# EAGLE design door_sensor (EAGLE 8.1.0)
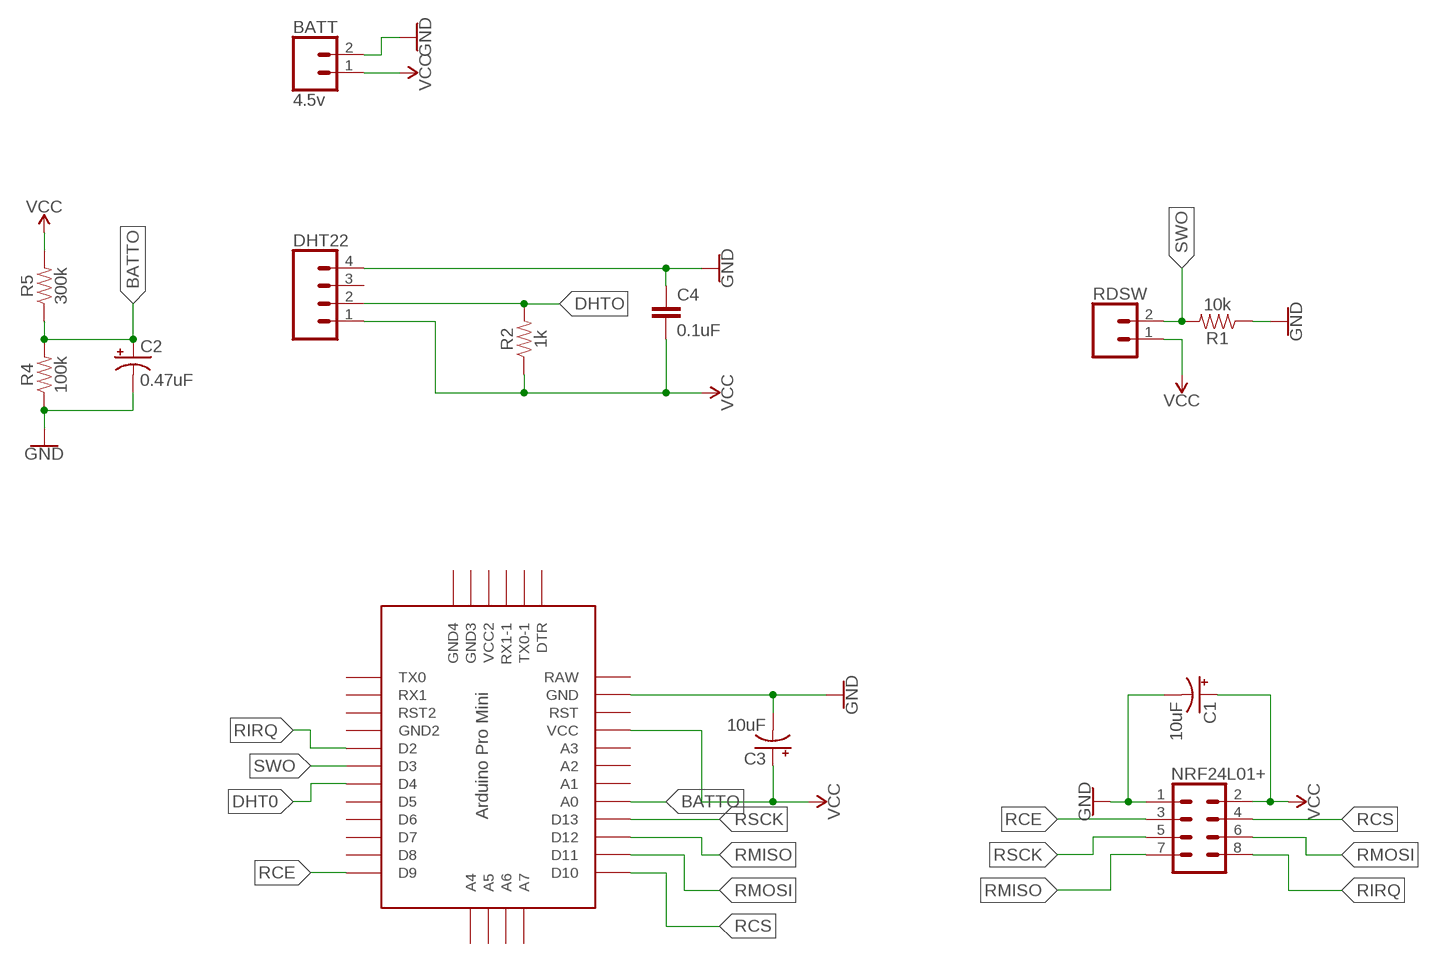
[diagram p0: schematic, sheet 1]

## Parts
BATT  4.5v  CONN_02  [1X02]
C1  10uF  10UF-POLAR-RADIAL-2.5MM-25V-20%  [CPOL-RADIAL-2.5MM-5MM]
C2  0.47uF  10UF-POLAR-RADIAL-2.5MM-25V-20%  [CPOL-RADIAL-2.5MM-5MM]
C3  10uF  10UF-POLAR-RADIAL-2.5MM-25V-20%  [CPOL-RADIAL-2.5MM-5MM]
C4  0.1uF  0.1UF-KIT-EZ-50V-20%  [CAP-PTH-SMALL-KIT]
DHT22  CONN_04  [1X04]
IC1  PRO-MINI  [PRO-MINI]
NRF24L01+  CONN_04X2  [2X4]
R1  10k  10KOHM-HORIZ-1/4W-1%  [AXIAL-0.3]
R2  1k  1KOHM-HORIZ-1/4W-5%  [AXIAL-0.3]
R4  100k  100KOHM-HORIZ-1/4W-1%  [AXIAL-0.3]
R5  300k  RESISTORAXIAL-0.3  [AXIAL-0.3]
RDSW  CONN_02  [1X02]

## Nets
BATTO: C2.1(+) IC1.A0 R4.P$2 R5.P$1
DHT0: IC1.D4
DHTO: DHT22.2 R2.P$2
GND: BATT.2 C1.2(-) C2.2(-) C3.2(-) C4.1 DHT22.4 IC1.GND NRF24L01+.1 R1.P$1 R4.P$1
RCE: IC1.D9 NRF24L01+.3
RCS: IC1.D10 NRF24L01+.4
RIRQ: IC1.D2 NRF24L01+.8
RMISO: IC1.D12 NRF24L01+.7
RMOSI: IC1.D11 NRF24L01+.6
RSCK: IC1.D13 NRF24L01+.5
SWO: IC1.D3 R1.P$2 RDSW.2
VCC: BATT.1 C1.1(+) C3.1(+) C4.2 DHT22.1 IC1.VCC NRF24L01+.2 R2.P$1 R5.P$2 RDSW.1
Unconnected: DHT22.3 IC1.A1 IC1.A2 IC1.A3 IC1.A4 IC1.A5 IC1.A6 IC1.A7 IC1.D5 IC1.D6 IC1.D7 IC1.D8 IC1.DTR IC1.GND1(GND2) IC1.GND2(GND4) IC1.GND3 IC1.RST IC1.RST1(RST2) IC1.RX1 IC1.RX1-1 IC1.TX0 IC1.TX0-1 IC1.VCC1(VCC2)

## Power pins joined to a net without a drawn wire
RAW: IC1.RAW

## Library data of the parts
BATT RDSW = SparkFun-Connectors:CONN_02: Multi connection point. Often used as Generic Header-pin footprint for 0.1 inch spaced/style header connections On any of the 0.1 inch spaced packages, you can populate with these: Break Away Headers - Straight <https://www.sparkfun.com/products/116> (PRT-00116) Break Away Male Headers - Right Angle <https://www.sparkfun.com/products/553> (PRT-00553) Female Headers <https://www.sparkfun.com/products/115> (PRT-00115) Break Away Headers - Machine Pin <https://www.sparkfun.com/products/117> (PRT-00117) Break Away Female Headers - Swiss Machine Pin <https://www.sparkfun.com/products/743> (PRT-00743) For SCREWTERMINALS and SPRING TERMINALS visit here: Screw Terimnals on SparkFun.com <https://www.sparkfun.com/search/results?term=Screw+Terminals> (5mm/3.5mm/2.54mm spacing) This device is also useful as a general connection point to wire up your design to another part of your project. Our various solder wires solder well into these plated through hole pads. Hook-Up Wire - Assortment (Stranded, 22 AWG) <https://www.sparkfun.com/products/11375> (PRT-11375) Hook-Up Wire - Assortment (Solid Core, 22 AWG) <https://www.sparkfun.com/products/11367> (PRT-11367) View the entire wire category on our website here <https://www.sparkfun.com/categories/141> Special notes: Molex polarized connector foot print use with: PRT-08233 with associated crimp pins and housings. 2.54_SCREWTERM for use with PRT-10571. 3.5mm Screw Terminal footprints for PRT-08084 5mm Screw Terminal footprints for use with PRT-08432
C1 C3 = SparkFun-Capacitors:10UF-POLAR: 10.0µF polarized capacitors A capacitor is a passive two-terminal electrical component used to store electrical energy temporarily in an electric field.; PROD_ID: CAP-08440
C2 = SparkFun-Capacitors:10UF-POLAR: 10.0µF polarized capacitors A capacitor is a passive two-terminal electrical component used to store electrical energy temporarily in an electric field.; PROD_ID: CAP-08440; VALUE: 10uF
C4 = SparkFun-Capacitors:0.1UF: 0.1µF ceramic capacitors A capacitor is a passive two-terminal electrical component used to store electrical energy temporarily in an electric field.; PROD_ID: CAP-08370
DHT22 = SparkFun-Connectors:CONN_04: Multi connection point. Often used as Generic Header-pin footprint for 0.1 inch spaced/style header connections On any of the 0.1 inch spaced packages, you can populate with these: Break Away Headers - Straight <https://www.sparkfun.com/products/116> (PRT-00116) Break Away Male Headers - Right Angle <https://www.sparkfun.com/products/553> (PRT-00553) Female Headers <https://www.sparkfun.com/products/115> (PRT-00115) Break Away Headers - Machine Pin <https://www.sparkfun.com/products/117> (PRT-00117) Break Away Female Headers - Swiss Machine Pin <https://www.sparkfun.com/products/743> (PRT-00743) For SCREWTERMINALS and SPRING TERMINALS visit here: Screw Terimnals on SparkFun.com <https://www.sparkfun.com/search/results?term=Screw+Terminals> (5mm/3.5mm/2.54mm spacing) This device is also useful as a general connection point to wire up your design to another part of your project. Our various solder wires solder well into these plated through hole pads. Hook-Up Wire - Assortment (Stranded, 22 AWG) <https://www.sparkfun.com/products/11375> (PRT-11375) Hook-Up Wire - Assortment (Solid Core, 22 AWG) <https://www.sparkfun.com/products/11367> (PRT-11367) View the entire wire category on our website here <https://www.sparkfun.com/categories/141> Special notes: Molex polarized connector foot print use with SKU : PRT-08231 with associated crimp pins and housings. 1MM SMD Version SKU: PRT-10208; PROD_ID: CONN-09696
IC1 = Arduino-clone:PRO-MINI: Arduion Pro Mini Clone V1.0 www.betemcu.cu
NRF24L01+ = SparkFun-Connectors:CONN_04X2: Multi connection point. Often used as Generic Header-pin footprint for 0.1 inch spaced/style header connections On any of the 0.1 inch spaced packages, you can populate with these: Break Away Headers - Straight <https://www.sparkfun.com/products/116> (PRT-00116) Break Away Male Headers - Right Angle <https://www.sparkfun.com/products/553> (PRT-00553) Female Headers <https://www.sparkfun.com/products/115> (PRT-00115) Break Away Headers - Machine Pin <https://www.sparkfun.com/products/117> (PRT-00117) Break Away Female Headers - Swiss Machine Pin <https://www.sparkfun.com/products/743> (PRT-00743)
R1 = SparkFun-Resistors:10KOHM: 10kΩ resistor A resistor is a passive two-terminal electrical component that implements electrical resistance as a circuit element. Resistors act to reduce current flow, and, at the same time, act to lower voltage levels within circuits. - Wikipedia; PROD_ID: RES-12183
R2 = SparkFun-Resistors:1KOHM: 1kΩ resistor A resistor is a passive two-terminal electrical component that implements electrical resistance as a circuit element. Resistors act to reduce current flow, and, at the same time, act to lower voltage levels within circuits. - Wikipedia; PROD_ID: RES-08380
R4 = SparkFun-Resistors:100KOHM: 100kΩ resistor A resistor is a passive two-terminal electrical component that implements electrical resistance as a circuit element. Resistors act to reduce current flow, and, at the same time, act to lower voltage levels within circuits. - Wikipedia; PROD_ID: RES-12184
R5 = SparkFun-Resistors:RESISTOR: Generic Resistor Package

## Board
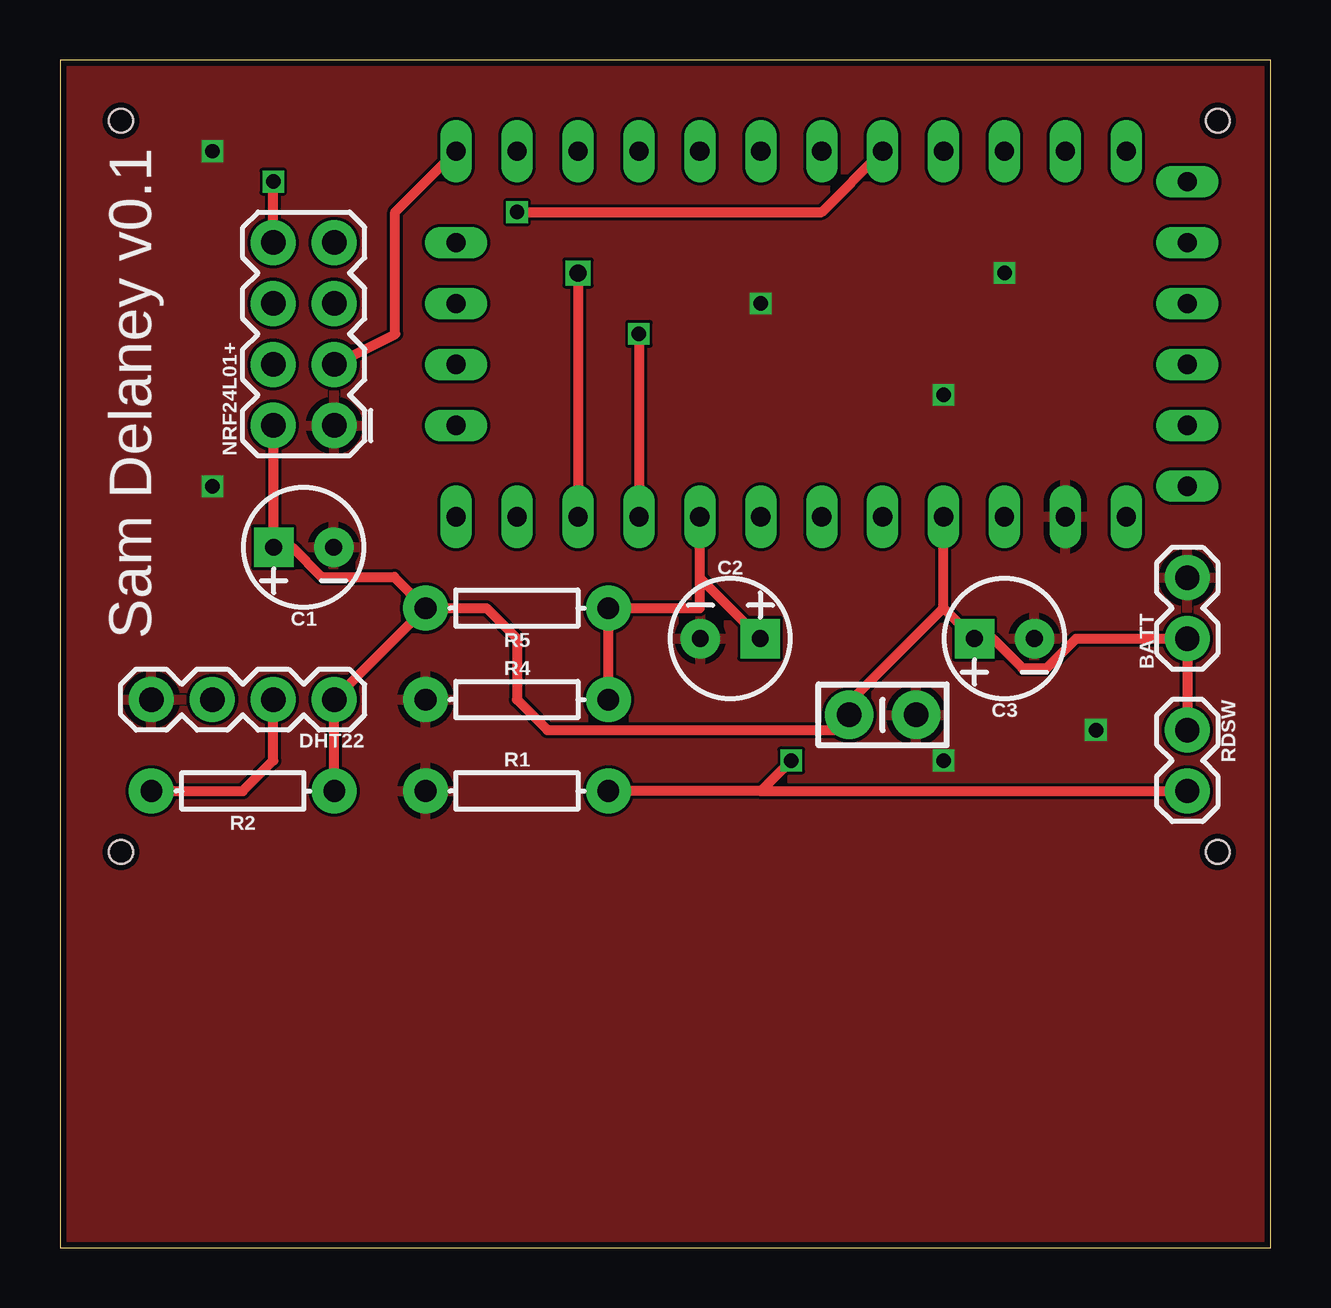
[diagram p1: board, top side]
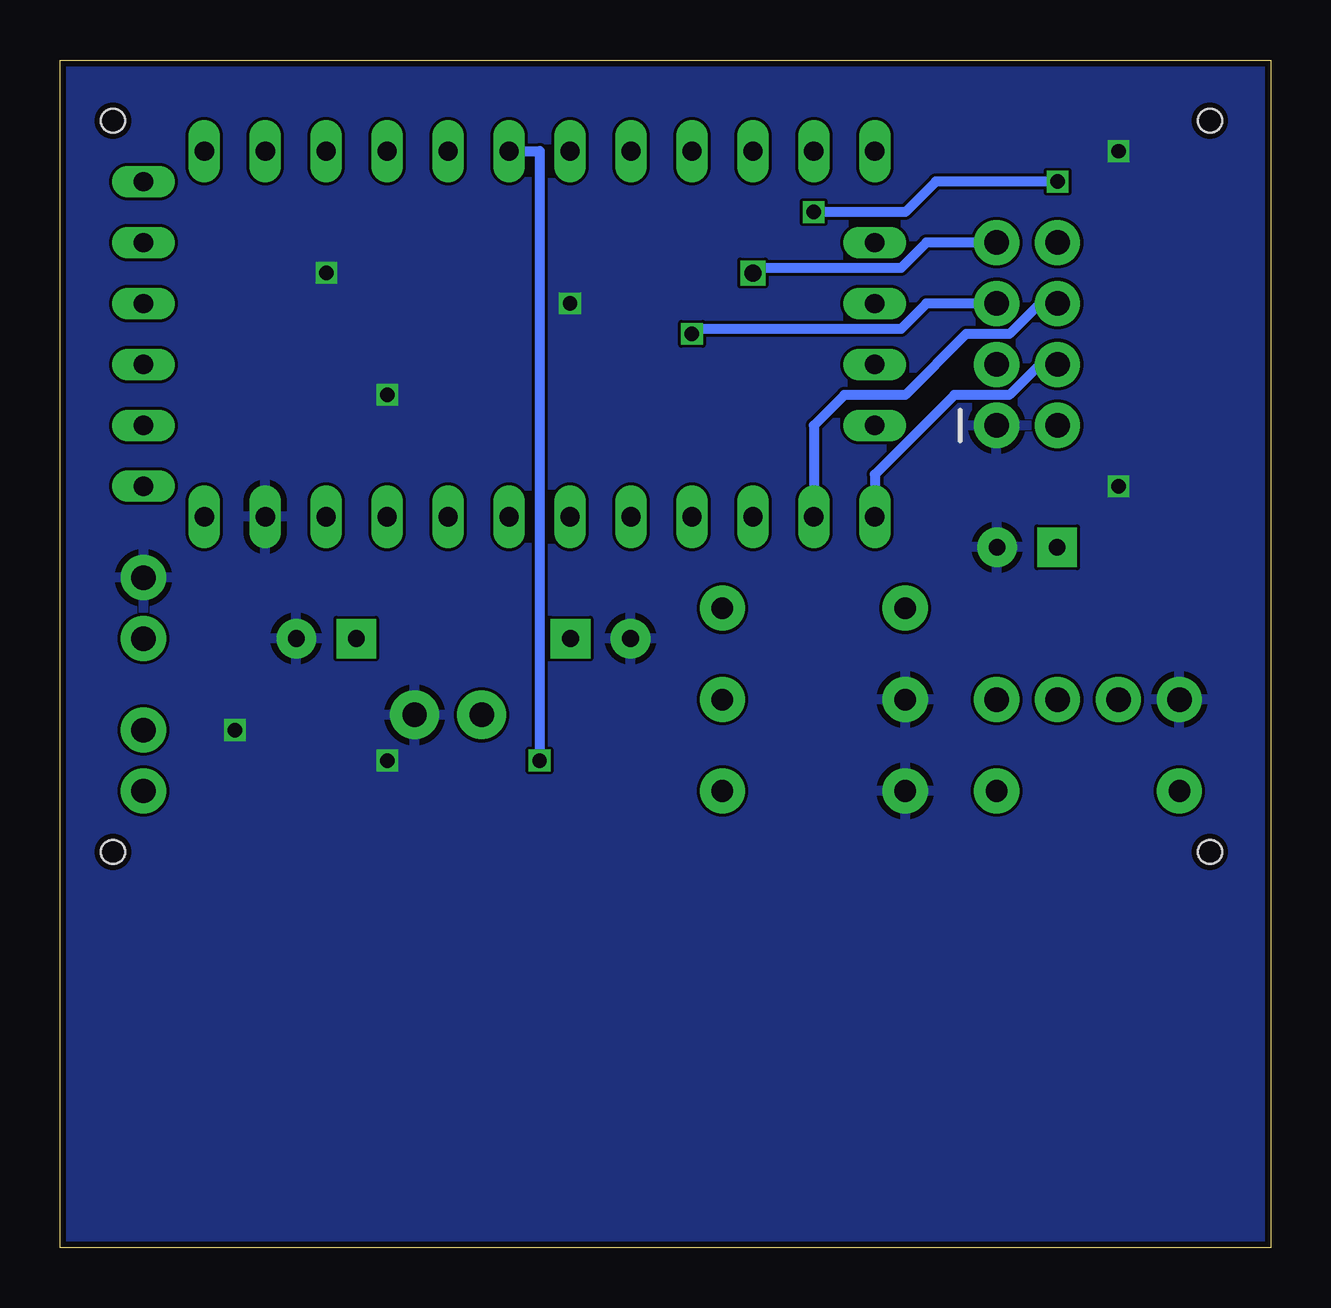
[diagram p2: board, bottom side, seen from below]

Size 50.47 x 49.52 mm. Coordinates in mm from the lower left corner, seen from the top.
Outline: 0,0 50.47,0 50.47,49.52 0,49.52 0,0
Copper layers (1*16): Top 0.035mm / dielectric 1.5mm / Bottom 0.035mm
Design rules "dirt_cheap_dirty_boards.v1": minimum track width 5mil, minimum drill 12mil, track to track 5mil, track to pad 5mil, pad to pad 5mil, via to via 5mil, smd to smd 0mil, copper to edge 10mil, drill to drill 10mil, minimum pad ring 10mil, minimum via ring 6mil, stop-mask expansion 2mil, vias tented up to drill 25mil, thermal gap 10mil
Holes 1 mm at 2.54,46.99 48.26,46.99 2.54,16.51 48.26,16.51

### Footprints (pad centres in the part's own frame; a part is rotated, then mirrored left to right if it is on the bottom)
1X02 = drill 1.016 pad 1.88: 1 0,0; 2 2.54,0
CPOL-RADIAL-2.5MM-5MM = drill 0.7 pad 1.651 square: 1 1.25,0 | drill 0.7 pad 1.651: 2 -1.25,0
CAP-PTH-SMALL-KIT = drill 1.016 pad 2.032: 1 -1.397,0; 2 1.397,0
1X04 = drill 1.016 pad 1.88: 1 0,0; 2 2.54,0; 3 5.08,0; 4 7.62,0
PRO-MINI = drill 0.8 long: A0 8.89,8.89; A1 8.89,11.43; A2 8.89,13.97; A3 8.89,16.51; A4 -2.54,-1.27; A5 0,-1.27; A6 2.54,-1.27; A7 5.08,-1.27; D2 -6.35,16.51; D3 -6.35,13.97; D4 -6.35,11.43; D5 -6.35,8.89; D6 -6.35,6.35; D7 -6.35,3.81; D8 -6.35,1.27; D9 -6.35,-1.27; D10 8.89,-1.27; D11 8.89,1.27; D12 8.89,3.81; D13 8.89,6.35; DTR 7.62,29.21; GND 8.89,24.13; GND1 -6.35,19.05; GND2 -5.08,29.21; GND3 -2.54,29.21; RAW 8.89,26.67; RST 8.89,21.59; RST1 -6.35,21.59; RX1 -6.35,24.13; RX1-1 2.54,29.21; TX0 -6.35,26.67; TX0-1 5.08,29.21; VCC 8.89,19.05; VCC1 0,29.21
2X4 = drill 1.016 pad 1.88: 1 -3.81,-1.27; 2 -3.81,1.27; 3 -1.27,-1.27; 4 -1.27,1.27; 5 1.27,-1.27; 6 1.27,1.27; 7 3.81,-1.27; 8 3.81,1.27
AXIAL-0.3 = drill 0.9 pad 1.88: P$1 -3.81,0; P$2 3.81,0

### Placement (x,y rotation side)
BATT  46.99,25.4 90 top
C1  10.16,29.21 180 top
C2  27.94,25.4 0 top
C3  39.37,25.4 180 top
C4  34.29,22.23 180 top
DHT22  11.43,22.86 180 top
IC1  17.78,39.37 270 top
NRF24L01+  10.16,38.1 90 top
R1  19.05,19.05 0 top
R2  7.62,19.05 180 top
R4  19.05,22.86 0 top
R5  19.05,26.67 180 top
RDSW  46.99,21.59 270 top

### Tracks (layer width: path | path; a pad name or v marks a point on that pad's centre or on a via)
BATTO
  Top 0.406: 26.67,27.92 C2.1 | 26.67,27.92 IC1.A0 | R4.P$2 R5.P$1 26.67,26.67 26.67,27.92
DHTO
  Top 0.406: R2.P$2 7.62,19.05 8.89,20.32 DHT22.2
GND  (via drill 0.6)
  other vias: 36.83,20.32 43.18,21.59 6.35,31.75 6.35,45.72 29.21,39.37 36.83,35.56 39.37,40.64
  pour Top: -1.27,50.8 52.07,50.8 52.07,-1.27 -1.27,-1.27 -1.27,5.08
  pour Bottom: -1.27,50.8 52.07,50.8 52.07,-1.27 -1.27,-1.27
RCE
  Top 0.406: NRF24L01+.3 13.97,38.1 13.97,43.18 IC1.D9
RCS
  Bottom 0.406: NRF24L01+.4 9.63,36.83 10.9,35.56 13.19,35.56 16.51,32.24 IC1.D10
RIRQ  (via drill 0.6)
  Top 0.406: NRF24L01+.8 v8.89,44.45 | v19.05,43.18 31.75,43.18 IC1.D2
  Bottom 0.406: v8.89,44.45 13.97,44.45 15.24,43.18 v19.05,43.18
RMISO  (via drill 0.7)
  Top 0.406: v21.59,40.64 IC1.D12
  Bottom 0.406: NRF24L01+.7 14.36,41.91 15.42,40.85 21.38,40.85 v21.59,40.64
RMOSI
  Bottom 0.406: NRF24L01+.6 9.63,39.37 10.9,38.1 12.7,38.1 15.24,35.56 17.78,35.56 19.05,34.29 IC1.D11
RSCK  (via drill 0.6)
  Top 0.406: v24.13,38.1 IC1.D13
  Bottom 0.406: NRF24L01+.5 14.36,39.37 15.42,38.31 23.92,38.31 v24.13,38.1
SWO  (via drill 0.6)
  Top 0.406: 29.21,19.05 R1.P$2 | 29.21,19.05 RDSW.2 | v30.48,20.32 29.21,19.05
  Bottom 0.406: IC1.D3 30.48,45.72 v30.48,20.32
VCC
  Top 0.406: RDSW.1 BATT.1 42.36,25.4 41.13,24.17 40.11,24.17 38.88,25.4 C3.1 36.83,26.67 | R5.P$2 DHT22.1 R2.P$1 | NRF24L01+.2 8.89,29.21 C1.1 9.67,29.21 10.9,27.98 13.93,27.98 R5.P$2 | 36.83,26.67 IC1.VCC | R5.P$2 17.78,26.67 19.05,25.4 19.05,22.86 20.32,21.59 32.26,21.59 C4.2 32.89,22.73 36.83,26.67

### Text on the board
tNames: Sam Delaney v0.1